# Altium schematic sheet Power.SchDoc: FIoT Rev 2.0
size A4; ApprovedBy: PM; CheckedBy: PM; Author: AG; CompanyName: -; DrawnBy: AG; Engineer: AG; DocumentNumber: 18072022 - 1; Revision: 0; SheetNumber: 5; SheetTotal: 8; ENG_APP_DATE: --/--/--; DSN_APP_DATE: --/--/--; CHK_APP_DATE: --/--/--
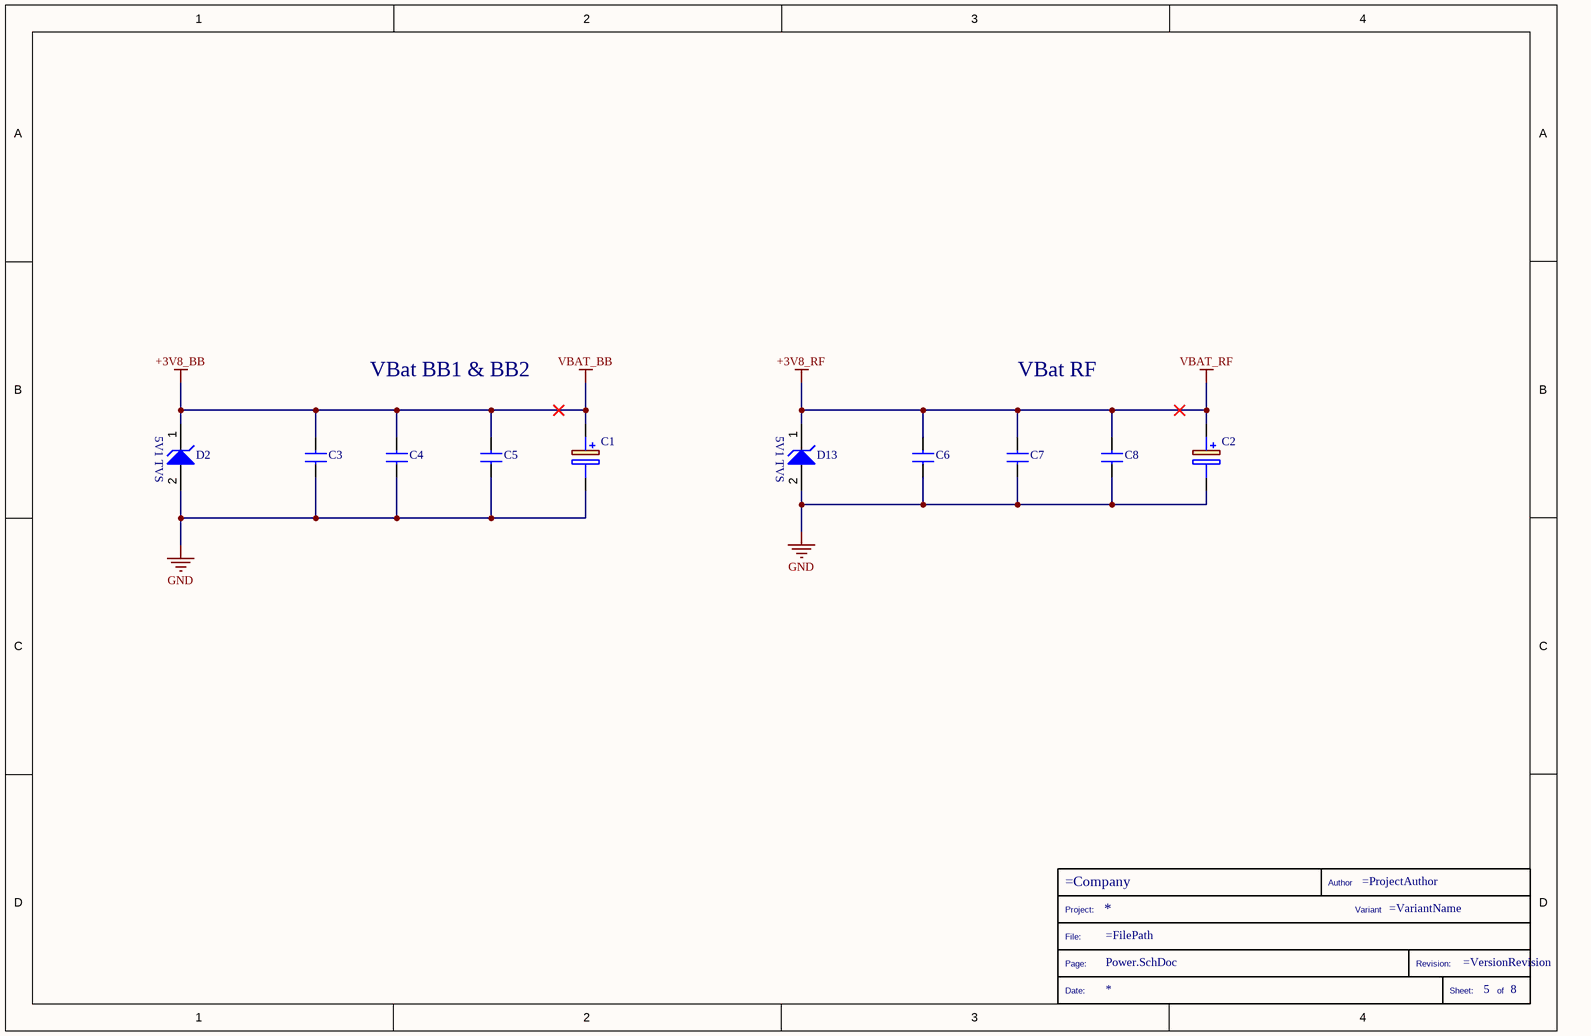
[diagram p0: Power.SchDoc]

## Parts
*?  TitleBlock  (value not drawn)  (graphical)
C1  T520A107M006ATE035  [CAPPM3216X180N]  (value not drawn)
C2  T520A107M006ATE035  [CAPPM3216X180N]  (value not drawn)
C3  GRM1555C1H6R0CA01D  [CAPC1005X06N]  (value not drawn)
C4  GJM1555C1H330GB01D  [CAPC1005X06N]  (value not drawn)
C5  CL05B104KB54PNC  [CAPC1005X06N]  (value not drawn)
C6  GRM1555C1H6R0CA01D  [CAPC1005X06N]  (value not drawn)
C7  GJM1555C1H330GB01D  [CAPC1005X06N]  (value not drawn)
C8  CL05B104KB54PNC  [CAPC1005X06N]  (value not drawn)
D2  PZ3D4V2H  [CR_SD05_SEM-L]  (value not drawn)
D13  PZ3D4V2H  [CR_SD05_SEM-L]  (value not drawn)

## Nets
+3V8_BB: C1.1(+) C3.2 C4.2 C5.2 D2.1(K)  [also labelled VBAT_BB]
+3V8_RF: C2.1(+) C6.2 C7.2 C8.2 D13.1(K)  [also labelled VBAT_RF]
GND: C1.2(-) C2.2(-) C3.1 C4.1 C5.1 C6.1 C7.1 C8.1 D2.2(A) D13.2(A)

## Notes on the sheet
- VBat BB1 & BB2
- VBat RF
- DWG. NO.
- REV.
- SHT.
- THIS DOCUMENT AND THE DATA DISCLOSED HEREIN OR HEREWITH IS THE PROPERTY OF ALTIUM LIMITED AND MAY BE FREELY DISTRIBUTED IN WHOLE. NO RIGHTS ARE RESERVED OR EXPRESS OR IMPLIED WARANTEE GIVEN.
- REVISION
- DESCRIPTION
- DATE
- APPROVED
- ENG:
- APPROVALS
- PROJECT
- DSN:
- CHK:
- REFERENCE DOCUMENTS
- PROJECT REVISION:
- TITLE
- DOCUMENT REVISION:
- DESIGN ITEM:
- BOM:
- FAB DWG:
- PCB DWG:
- ASSY DWG:
- SCALE:
- SIZE
- B
- CAGE CODE
- FILE NAME
- DWG NO.
- SHEET
- OF
- REV
- (in symbol LPN00016) 5V1 TVS
- (in symbol TitleBlock) Author; Project:; Variant; File:; Page:; Revision:; Date:; Sheet:; of

## Library data of the parts
C1 C2 = LPN00018: Tantalum Capacitors - Polymer 6.3 VDC 100uF 1206 20% ESR=35mOhms; Supplier 1: Farnell; Supplier Part Number 1: 2855176; Lumen Part Number: LPN00018
C3 C6 = LPN0008: 5.6pF 50V NP0 ±0.1pF 0402 MLCC; Manufacturer 1: TDK; Manufacturer Part Number 1: C1005C0G1H060C; Supplier 1: Digi-Key; Supplier Part Number 1: 490-8222-1-ND; Lumen Part Number: LPN0008
C4 C7 = LPN00014: 33pF 50V C0G ±2% 0402 MLCC; Manufacturer 1: TDK; Manufacturer Part Number 1: C1005C0G1H060C; Supplier 1: Farnell; Supplier Part Number 1: 3784396; Lumen Part Number: LPN00014
C5 C8 = LPN0009: 100nF 50V X7R ±10% 0402 MLCC; Manufacturer 1: TDK; Manufacturer Part Number 1: C1005C0G1H060C; Supplier 1: Digi-Key; Supplier Part Number 1: 1276-CL05B104KB54PNCCT-ND; Lumen Part Number: LPN0009
D2 D13 = LPN00016: 5uA@4.2V 55O Single 500mW 5.1V SOD-323 Zener Diodes ROHS; Lumen Part Number: LPN00016